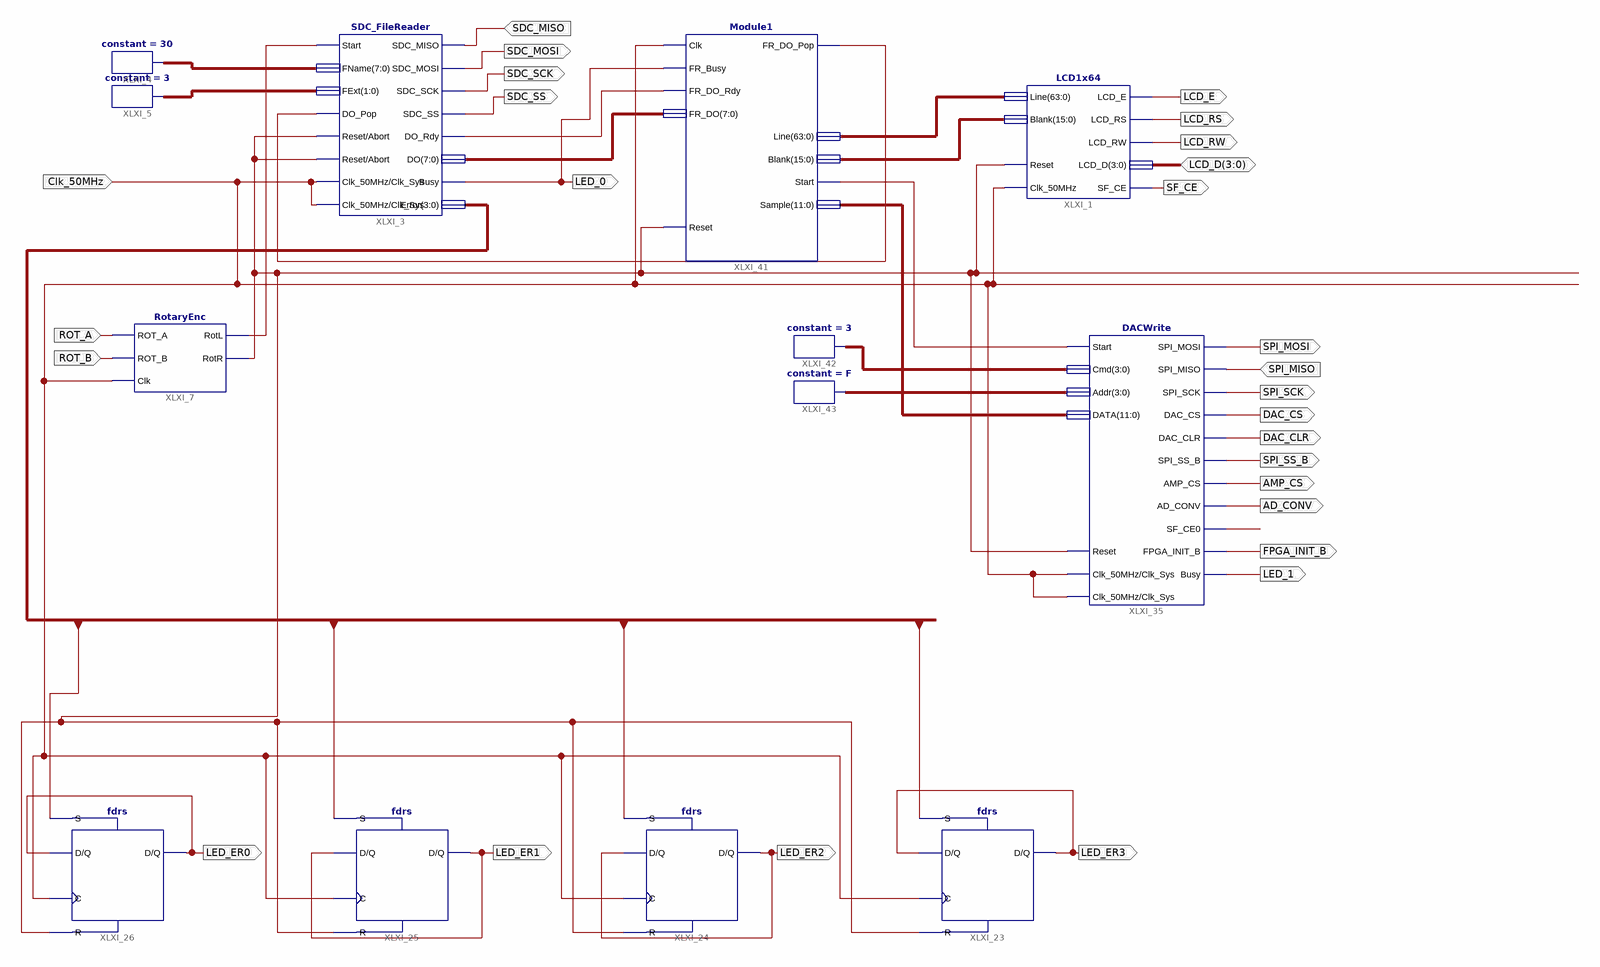
[diagram p0: schematic sheet 1]
// Xilinx ISE schematic Schematic_1.sch (spartan3e) as structural Verilog: 13 symbols, 27 ports
module Schematic_1 (
  input  SDC_MISO,
  input  ROT_A,
  input  ROT_B,
  input  Clk_50MHz,
  input  SPI_MISO,
  inout  [3:0] LCD_D,
  output LED_0,
  output SDC_MOSI,
  output SDC_SCK,
  output SDC_SS,
  output LED_ER0,
  output LED_ER1,
  output LED_ER2,
  output LED_ER3,
  output LCD_RS,
  output LCD_RW,
  output LCD_E,
  output SPI_MOSI,
  output SPI_SCK,
  output DAC_CS,
  output DAC_CLR,
  output SPI_SS_B,
  output AMP_CS,
  output AD_CONV,
  output FPGA_INIT_B,
  output LED_1,
  output SF_CE
);

  wire Reset, SF_CE0, XLXN_77, XLXN_262, XLXN_267, XLXN_276;
  wire [1:0] XLXN_39;
  wire [3:0] ERROR, XLXN_278, XLXN_279;
  wire [7:0] XLXN_38, XLXN_268;
  wire [11:0] XLXN_274;
  wire [15:0] XLXN_230;
  wire [63:0] XLXN_229;

  SDC_FileReader XLXI_3 (
    .SDC_MISO(SDC_MISO), .Start(XLXN_77), .FName(XLXN_38), .Reset(Reset), .Clk_50MHz(Clk_50MHz),
    .DO_Pop(XLXN_262), .Abort(Reset), .SDC_MOSI(SDC_MOSI), .SDC_SCK(SDC_SCK), .SDC_SS(SDC_SS), .Error(ERROR),
    .DO(XLXN_268), .DO_Rdy(XLXN_267), .Busy(LED_0), .FExt(XLXN_39), .Clk_Sys(Clk_50MHz));
  constant #(.CValue("30")) XLXI_4 (.O(XLXN_38));
  constant #(.CValue("3")) XLXI_5 (.O(XLXN_39));
  RotaryEnc XLXI_7 (.ROT_A(ROT_A), .ROT_B(ROT_B), .RotL(XLXN_77), .RotR(Reset), .Clk(Clk_50MHz));
  fdrs XLXI_26 (.C(Clk_50MHz), .D(LED_ER0), .R(Reset), .S(ERROR[0]), .Q(LED_ER0));
  fdrs XLXI_25 (.C(Clk_50MHz), .D(LED_ER1), .R(Reset), .S(ERROR[1]), .Q(LED_ER1));
  fdrs XLXI_24 (.C(Clk_50MHz), .D(LED_ER2), .R(Reset), .S(ERROR[2]), .Q(LED_ER2));
  fdrs XLXI_23 (.C(Clk_50MHz), .D(LED_ER3), .R(Reset), .S(ERROR[3]), .Q(LED_ER3));
  LCD1x64 XLXI_1 (
    .Clk_50MHz(Clk_50MHz), .Reset(Reset), .Line(XLXN_229), .Blank(XLXN_230), .LCD_D(LCD_D), .LCD_E(LCD_E),
    .LCD_RW(LCD_RW), .LCD_RS(LCD_RS), .SF_CE(SF_CE));
  Module1 XLXI_41 (
    .Clk(Clk_50MHz), .FR_Busy(LED_0), .Reset(Reset), .FR_DO_Rdy(XLXN_267), .FR_DO(XLXN_268),
    .FR_DO_Pop(XLXN_262), .Start(XLXN_276), .Line(XLXN_229), .Blank(XLXN_230), .Sample(XLXN_274));
  DACWrite XLXI_35 (
    .Reset(Reset), .Start(XLXN_276), .SPI_MISO(SPI_MISO), .Cmd(XLXN_279), .Addr(XLXN_278), .DATA(XLXN_274),
    .DAC_CLR(DAC_CLR), .DAC_CS(DAC_CS), .SPI_MOSI(SPI_MOSI), .SPI_SCK(SPI_SCK), .SPI_SS_B(SPI_SS_B),
    .AMP_CS(AMP_CS), .AD_CONV(AD_CONV), .SF_CE0(SF_CE0), .FPGA_INIT_B(FPGA_INIT_B), .Busy(LED_1),
    .Clk_50MHz(Clk_50MHz), .Clk_Sys(Clk_50MHz));
  constant #(.CValue("3")) XLXI_42 (.O(XLXN_279));
  constant #(.CValue("F")) XLXI_43 (.O(XLXN_278));
endmodule
